# Altium schematic sheet Sheet1.SchDoc
size A
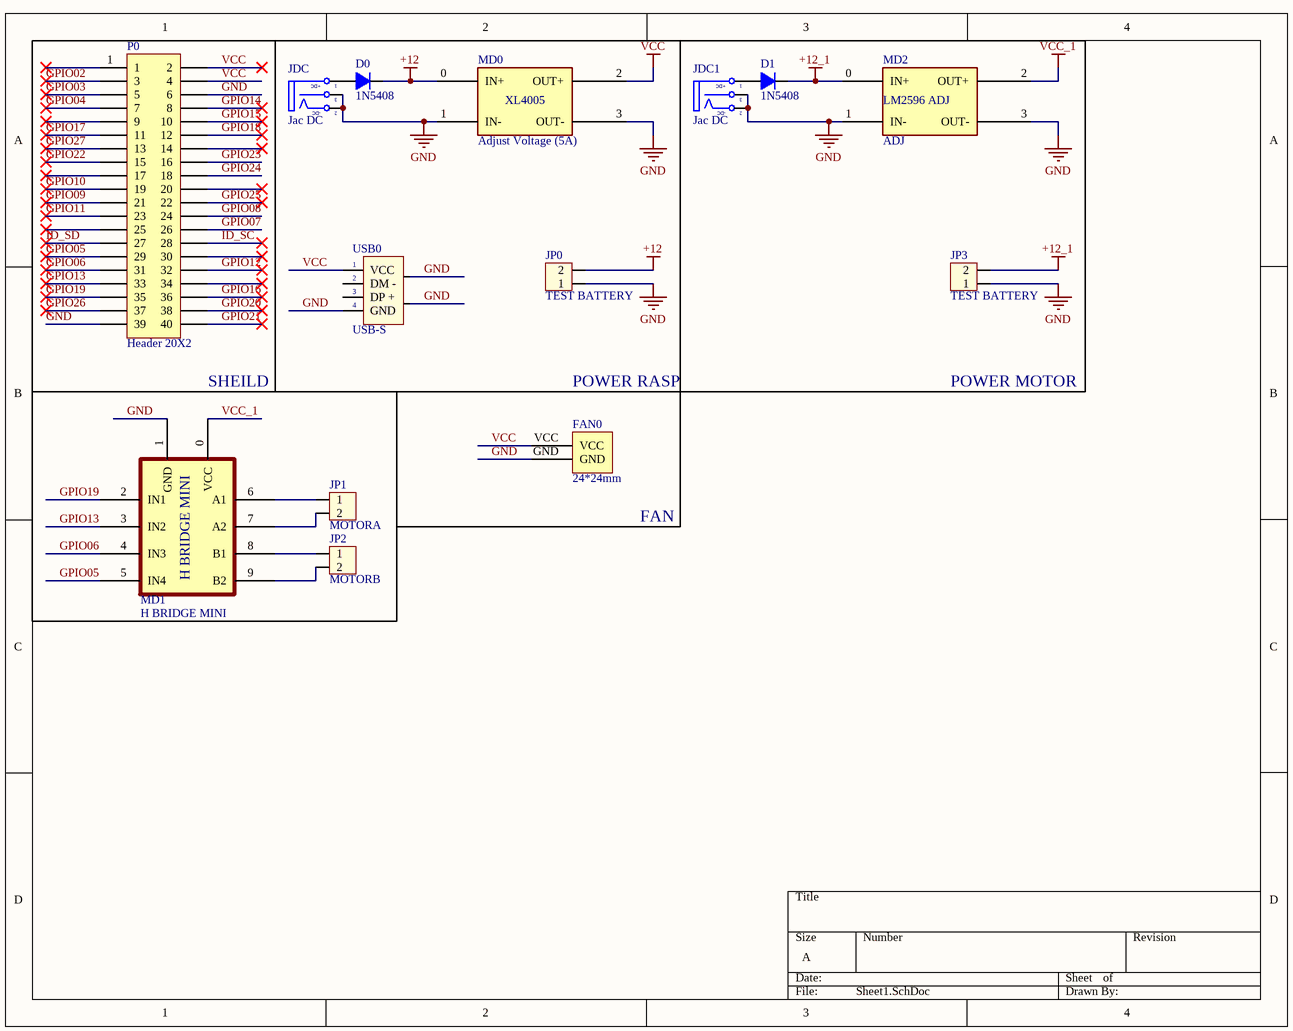
[diagram p0: Sheet1.SchDoc]

## Parts
D0  1N5408  [D5A]
D1  1N5408  [D5A]
FAN0  24*24mm  [FAN DC]
JDC  Jac DC  [DC-IN]
JDC1  Jac DC  [DC-IN]
JP0  TEST BATTERY  [CON2]
JP1  MOTORA  [CON2]
JP2  MOTORB  [CON2]
JP3  TEST BATTERY  [CON2]
MD0  Adjust Voltage (5A)  [XL4005]
MD1  H BRIDGE MINI  [H BRIDGE MINI]
MD2  ADJ  [LM2596-ADJ]
P0  Header 20X2  [HDR2X20]
USB0  USB-S  [USB-A]

## Blocks framed on the sheet
SHEILD: P0

## Nets
+12: D0.2(K) JP0.2 MD0.0(IN+)
+12_1: D1.2(K) JP3.2 MD2.0(IN+)
GND: FAN0.GND JDC.2(TN) JDC.3(S) JDC1.2(TN) JDC1.3(S) JP0.1 JP3.1 MD0.1(IN-) MD0.3(OUT-) MD1.1(GND) MD2.1(IN-) MD2.3(OUT-) P0.6 P0.39 USB0.4(GND) USB0.5 USB0.6
VCC: FAN0.VCC MD0.2(OUT+) P0.2 P0.4 USB0.1(VCC)
VCC_1: MD1.0(VCC) MD2.2(OUT+)
GPIO02: P0.3
GPIO03: P0.5
GPIO04: P0.7
GPIO05: MD1.5(IN4) P0.29
GPIO06: MD1.4(IN3) P0.31
GPIO07: P0.26
GPIO08: P0.24
GPIO09: P0.21
GPIO10: P0.19
GPIO11: P0.23
GPIO12: P0.32
GPIO13: MD1.3(IN2) P0.33
GPIO14: P0.8
GPIO15: P0.10
GPIO16: P0.36
GPIO17: P0.11
GPIO18: P0.12
GPIO19: MD1.2(IN1) P0.35
GPIO20: P0.38
GPIO21: P0.40
GPIO22: P0.15
GPIO23: P0.16
GPIO24: P0.18
GPIO25: P0.22
GPIO26: P0.37
GPIO27: P0.13
ID_SC: P0.28
ID_SD: P0.27
NetD0_1: D0.1(A) JDC.1(T)
NetD1_1: D1.1(A) JDC1.1(T)
NetJP1_1: JP1.1 MD1.6(A1)
NetJP1_2: JP1.2 MD1.7(A2)
NetJP2_1: JP2.1 MD1.8(B1)
NetJP2_2: JP2.2 MD1.9(B2)

Not connected (* = marked no-connect by the designer): P0 1* 9* 14* 17* 20* 25* 30* 34*; USB0 2(DM_-) 3(DP_+)

## Notes on the sheet
- POWER RASP
- POWER MOTOR
- FAN
- (in symbol DCIN) +DC; -DC
- (in symbol LM2596) LM2596 ADJ

## Library data of the parts
D0 D1 = D5A: Diode 5A; Value: 1N5408
FAN0 = FAN 24*24mm
JDC JDC1 = DCIN: Jac DC input; Value: Jac DC
JP0-JP3 = Con2: Connector 2; Value: Connector 2
MD0 = XL4005
MD1 = H BRIDGE MINI: MX1508
MD2 = LM2596: Manage voltage
P0 = Header 20X2: Header, 20-Pin, Dual row; LatestRevisionDate: 17-Jul-2002; LatestRevisionNote: Re-released for DXP Platform.; Publisher: Altium Limited
USB0 = USB_S: USB connector; Value: USB